# Altium schematic sheet STM32L431RCT6-BASIC.SchDoc
size A; SheetNumber: 2; SheetTotal: 7
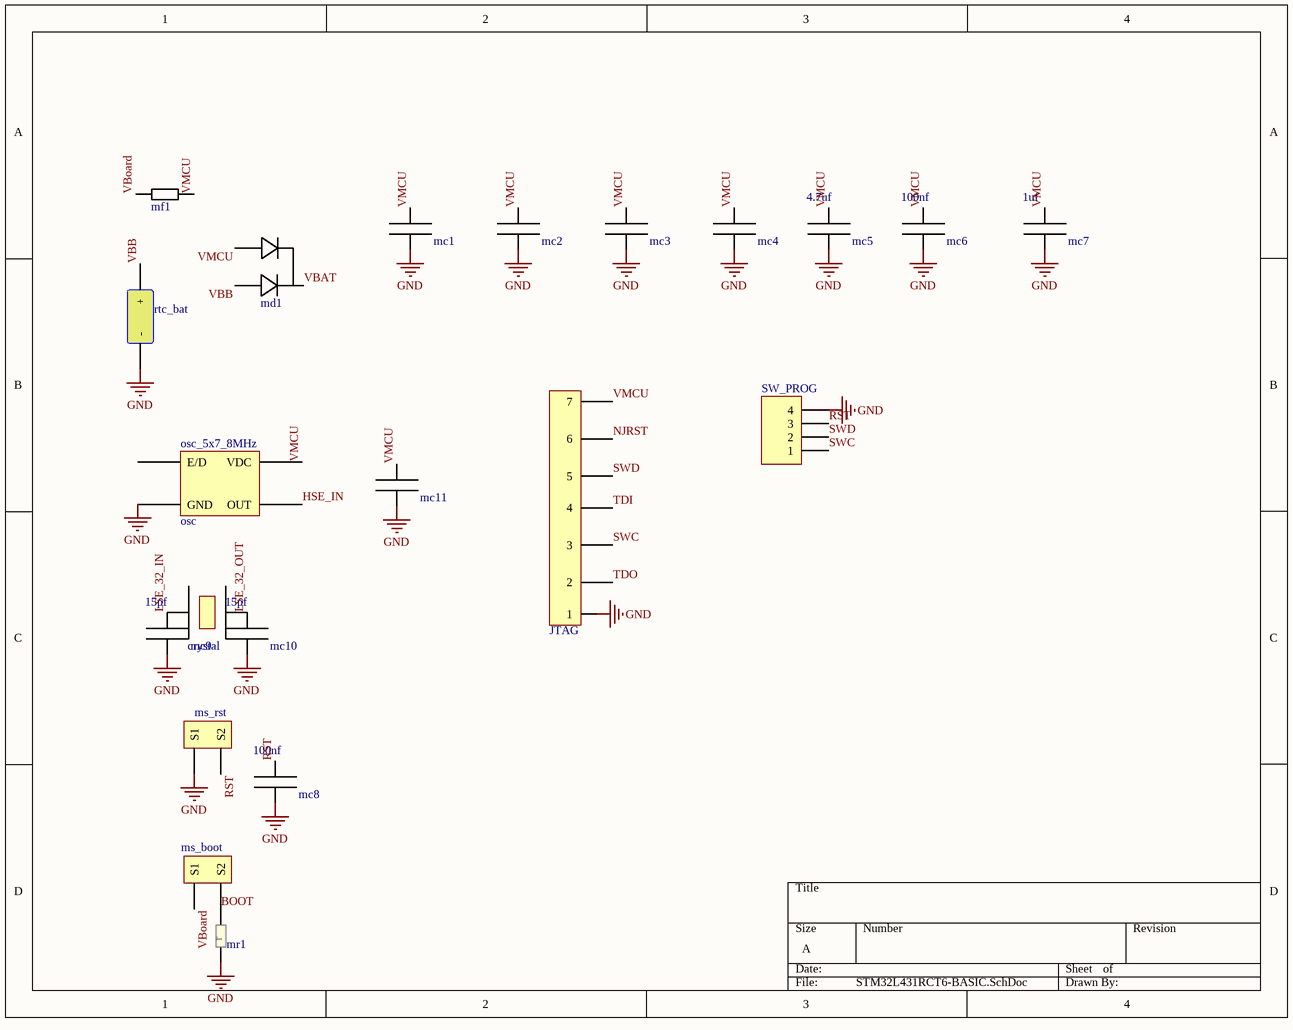
[diagram p0: STM32L431RCT6-BASIC.SchDoc]

## Parts
crystal_smd_32k  crystal  [abr_crystal_cm405_32k_3d]
JTAG  pin header 2mm  [abr_ph_1x7_2mm_2d_female]  (value not drawn)
mc1  100nf  [abr_cap_0805_3d]  (value not drawn)
mc2  100nf  [abr_cap_0805_3d]  (value not drawn)
mc3  100nf  [abr_cap_0805_3d]  (value not drawn)
mc4  100nf  [abr_cap_0805_3d]  (value not drawn)
mc5  4.7uf  [abr_cap_0805_3d]
mc6  100nf  [abr_cap_0805_3d]
mc7  1uf  [abr_cap_0805_3d]
mc8  100nf  [abr_cap_0805_3d]
mc9  15pf  [abr_cap_0805_3d]
mc10  15pf  [abr_cap_0805_3d]
mc11  100nf  [abr_cap_0805_3d]  (value not drawn)
md1  abr_diode_shotkey  [abr_diode_bat54c_3d]  (value not drawn)
mf1  smd-0805  [abr_fer_0805_3d]  (value not drawn)
mr1  10k  [abr_res_0805_3d]  (value not drawn)
ms_boot  switch  [abr_sw_tact_3d]  (value not drawn)
ms_rst  switch  [abr_sw_tact_3d]  (value not drawn)
osc_5x7_8MHz  osc  [abr_osc_5x7_3d]
rtc_bat  battery holder  [abr_bh_cr1220_3d]  (value not drawn)
SW_PROG  Header 4  [HDR1X4]  (value not drawn)

## Nets
GND: JTAG.1 mc1.0 mc2.0 mc3.0 mc4.0 mc5.0 mc6.0 mc7.0 mc8.0 mc9.0 mc10.0 mc11.0 mr1.0 ms_rst.1(S1) osc_5x7_8MHz.2(GND) rtc_bat.2(-) SW_PROG.4
BOOT: mr1.1 ms_boot.2(S2)
HSE_IN: osc_5x7_8MHz.3(OUT)
LSE_32_IN: crystal_smd_32k.1 mc9.1
LSE_32_OUT: crystal_smd_32k.2 mc10.1
NJRST: JTAG.6
RST: mc8.1 ms_rst.2(S2) SW_PROG.3
SWC: JTAG.3 SW_PROG.1
SWD: JTAG.5 SW_PROG.2
TDI: JTAG.4
TDO: JTAG.2
VBAT: md1.3
VBB: md1.2 rtc_bat.1(+)
VBoard: mf1.0 ms_boot.1(S1)
VMCU: JTAG.7 mc1.1 mc2.1 mc3.1 mc4.1 mc5.1 mc6.1 mc7.1 mc11.1 md1.1 mf1.1 osc_5x7_8MHz.4(VDC)

Not connected (* = marked no-connect by the designer): osc_5x7_8MHz 1(E/D)

## Notes on the sheet
- (in symbol abr_res_0805) r

## Library data of the parts
crystal_smd_32k = abr_crystal_smd_32K
JTAG = abr_1x7_2mm
mc1-mc11 = abr_cap_0805
md1 = abr_diode_shatkey_bat54c
mf1 = abr_fer_0805
mr1 = abr_res_0805
ms_boot ms_rst = abr_switch_tact
osc_5x7_8MHz = abr_osc_5x7
rtc_bat = abr_bh_rtc
SW_PROG = Header 4: Header, 4-Pin; LatestRevisionDate: 17-Jul-2002; LatestRevisionNote: Re-released for DXP Platform.; Publisher: Altium Limited